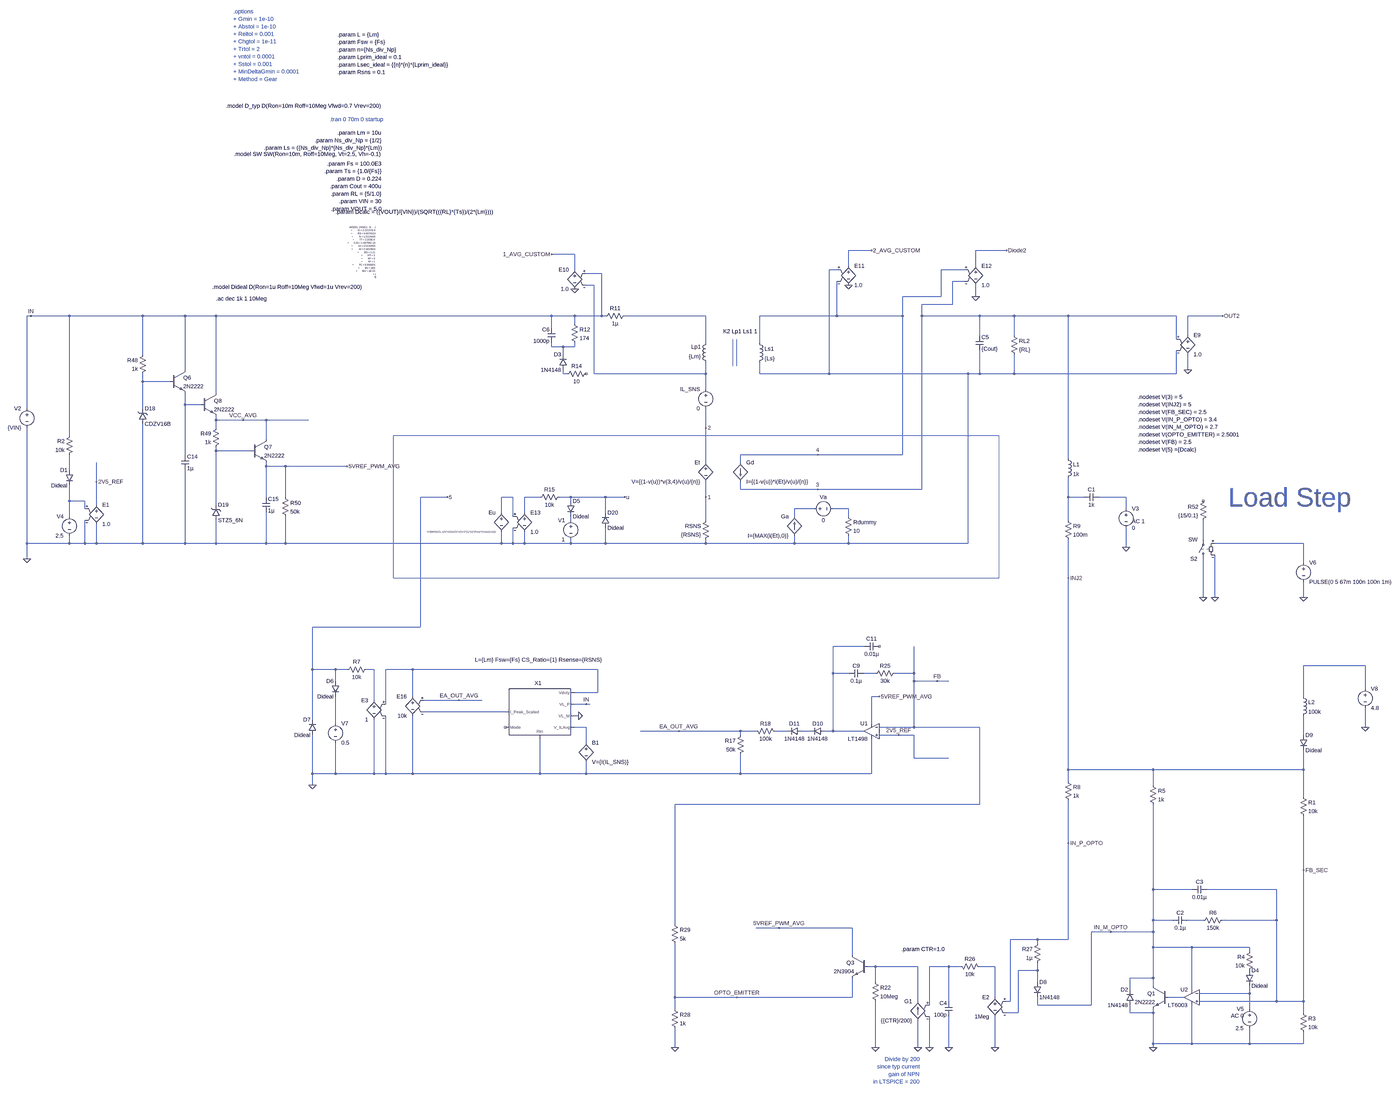
[diagram p0: schematic Flyback_Basic_Model_30V_to_5V_Out_TL431_Opto_FB_AVGD_Model.asc, whole sheet]
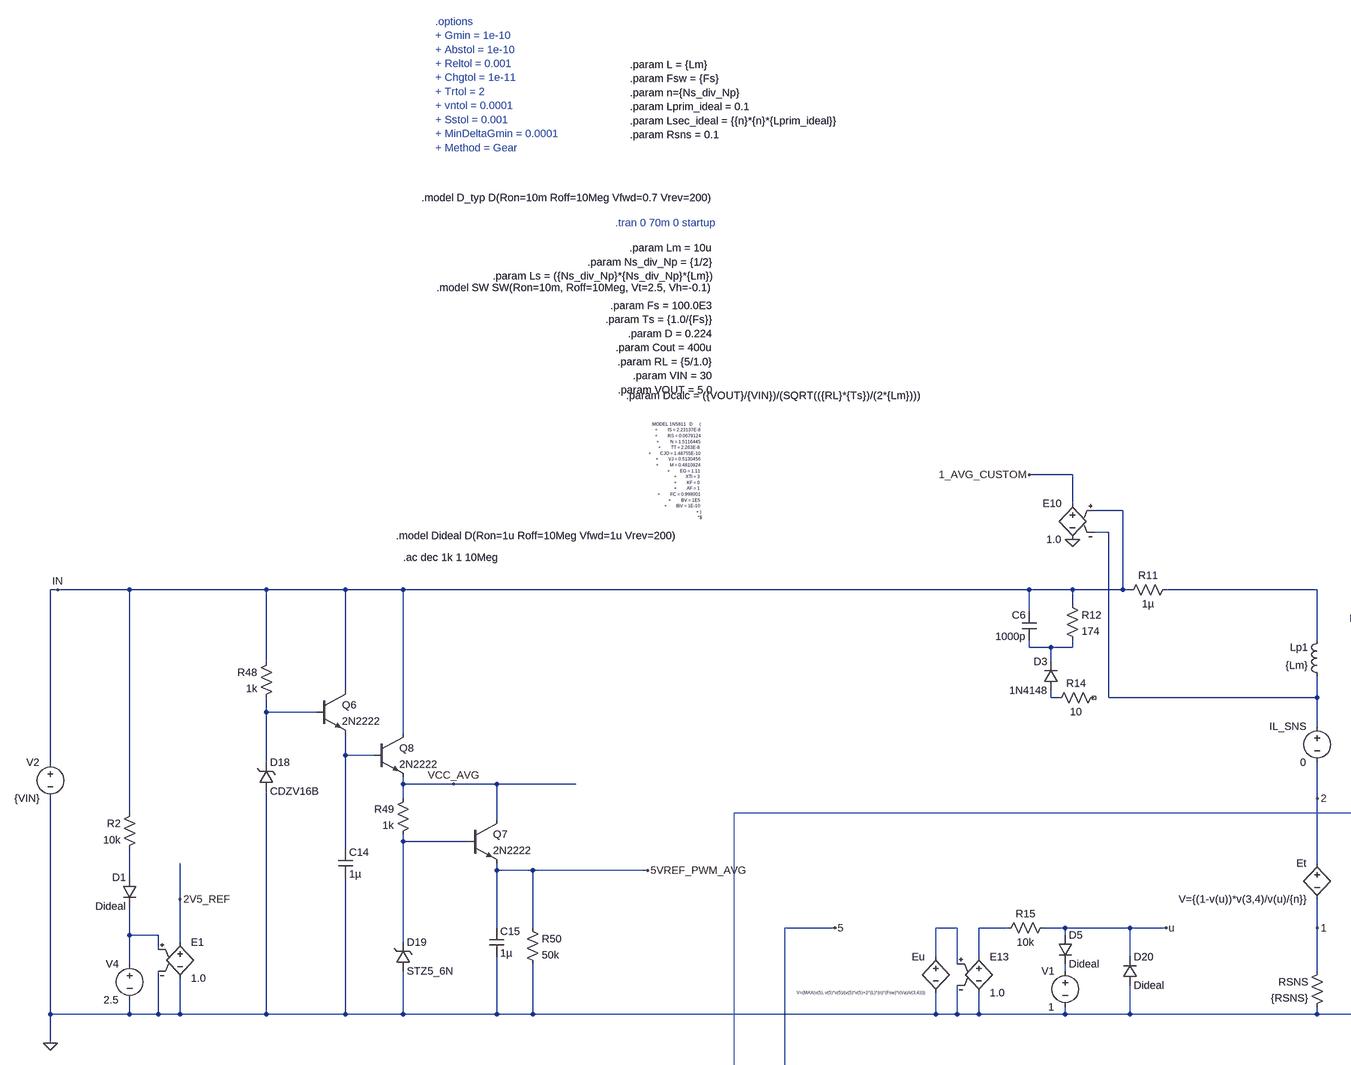
[diagram p1: schematic Flyback_Basic_Model_30V_to_5V_Out_TL431_Opto_FB_AVGD_Model.asc, part, row 1 of 2, column 1 of 2]
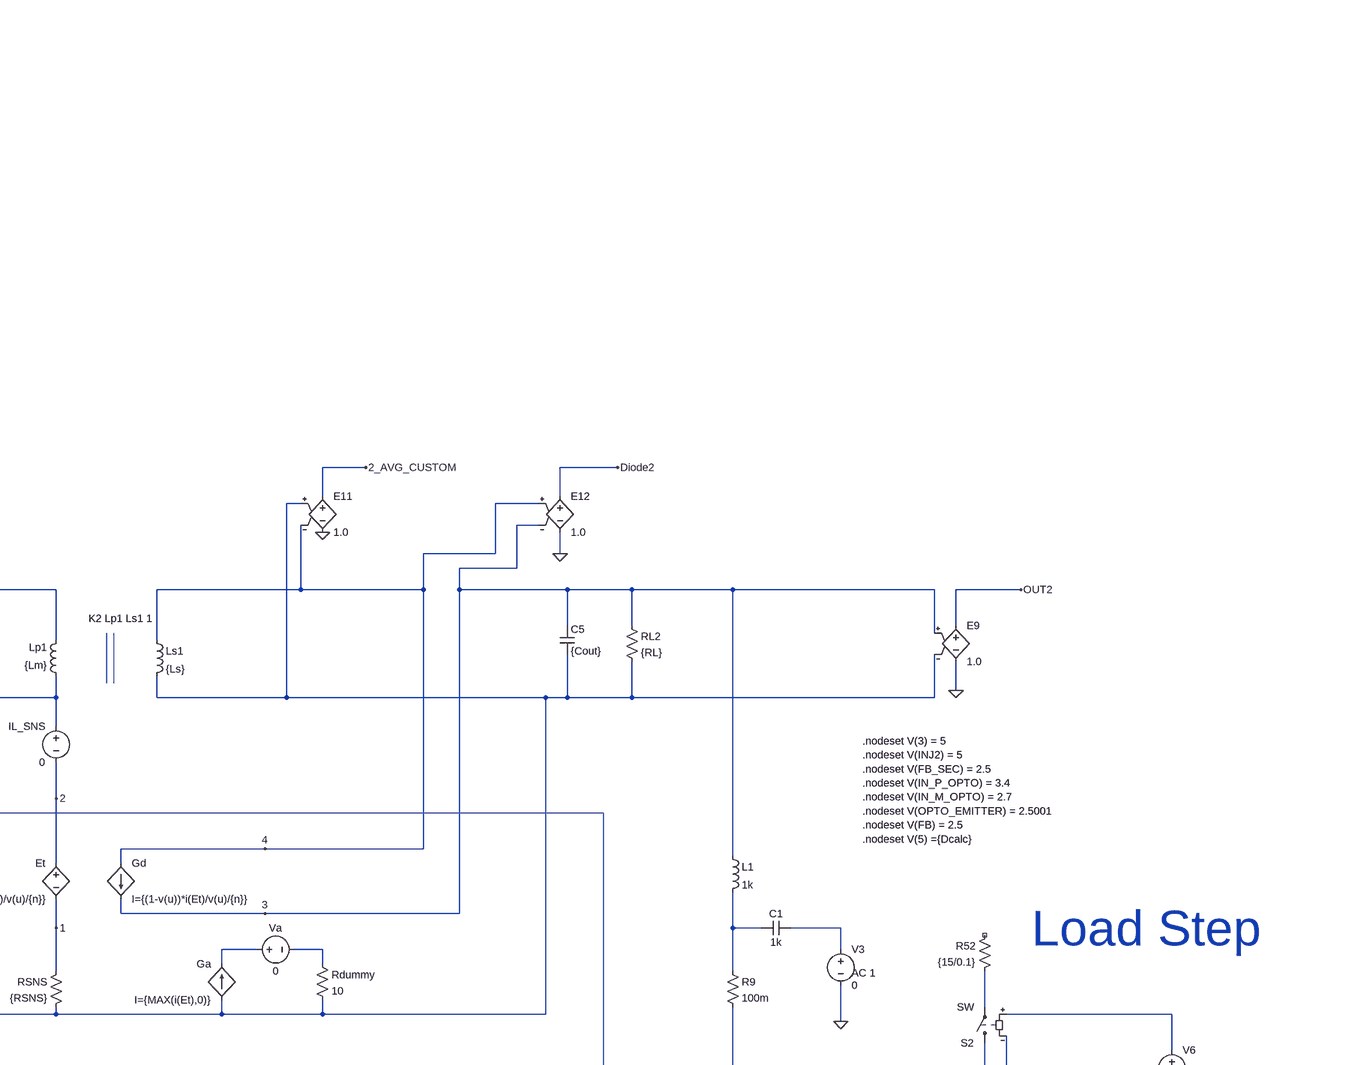
[diagram p2: schematic Flyback_Basic_Model_30V_to_5V_Out_TL431_Opto_FB_AVGD_Model.asc, part, row 1 of 2, column 2 of 2]
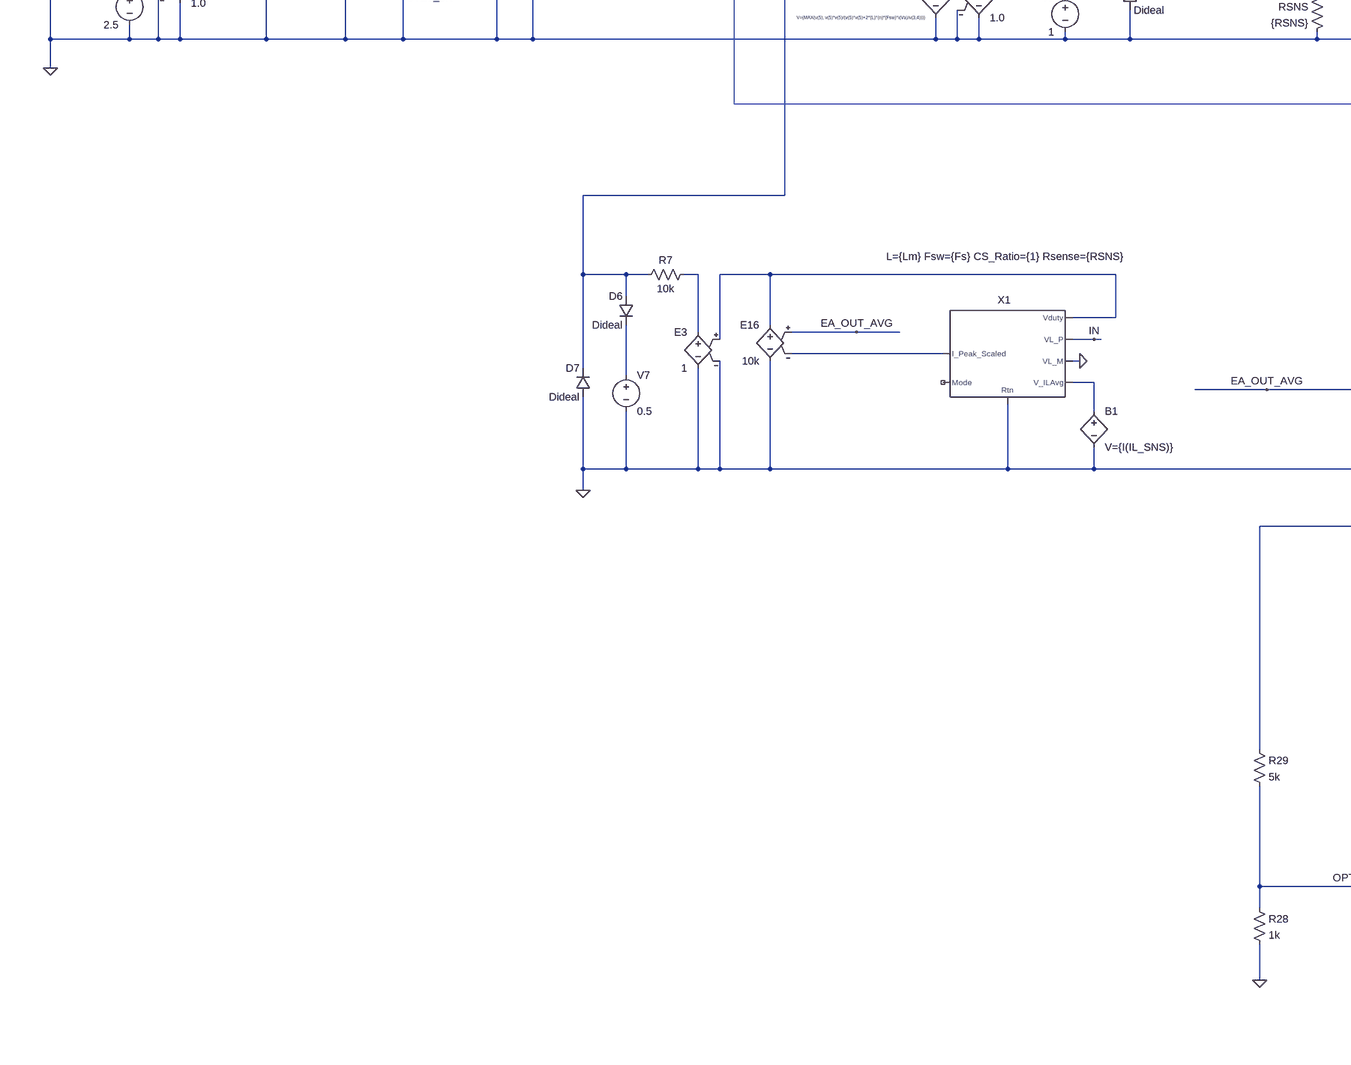
[diagram p3: schematic Flyback_Basic_Model_30V_to_5V_Out_TL431_Opto_FB_AVGD_Model.asc, part, row 2 of 2, column 1 of 2]
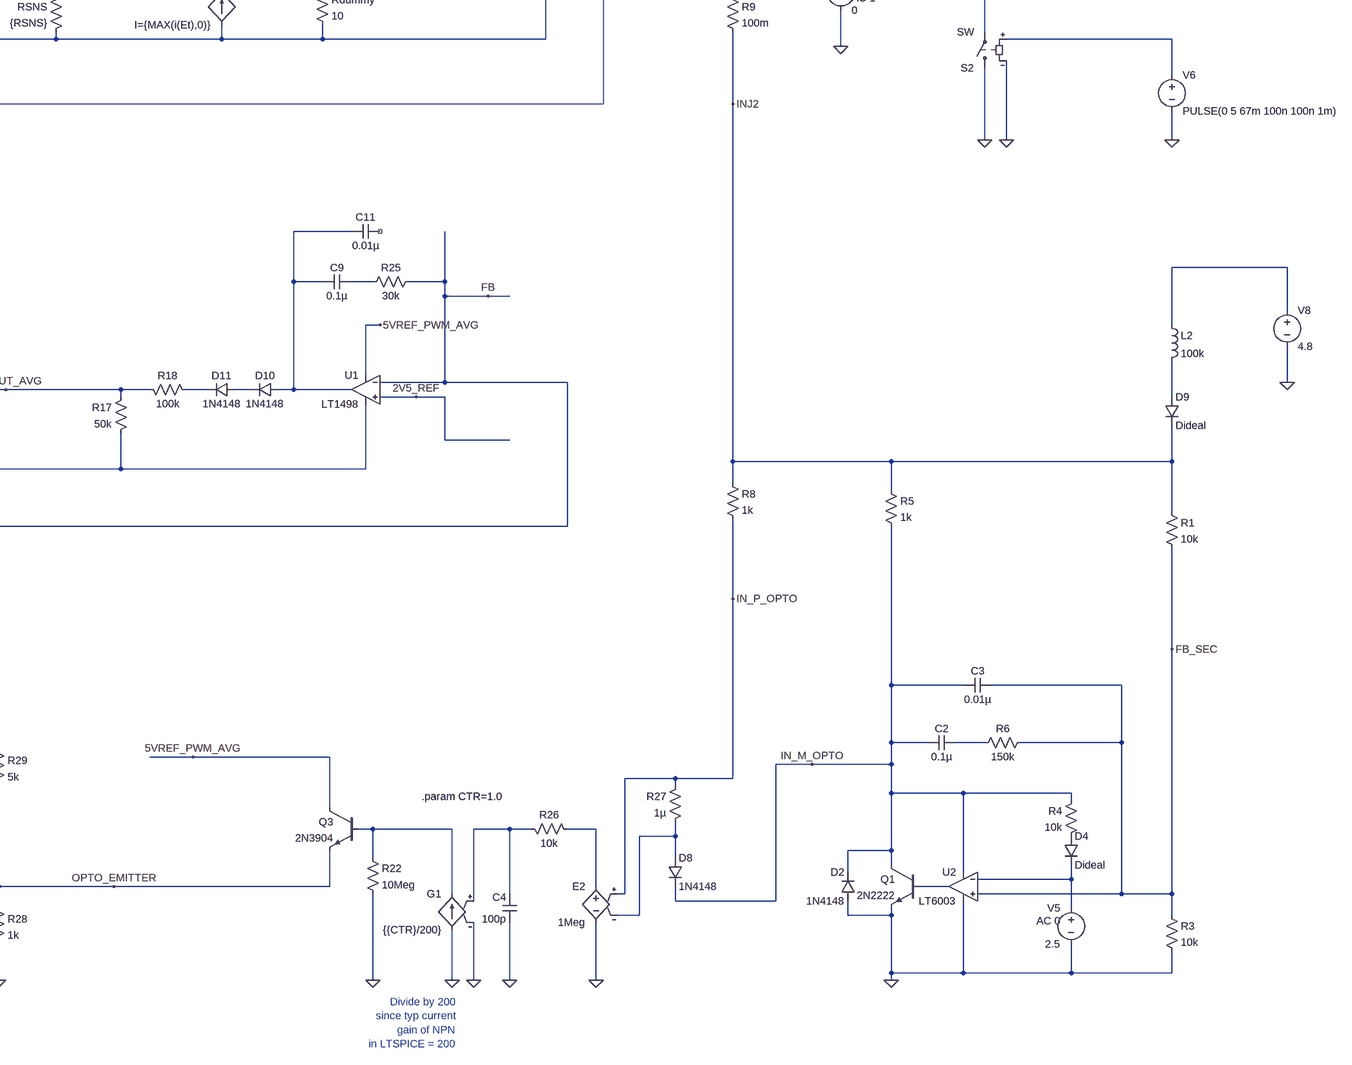
[diagram p4: schematic Flyback_Basic_Model_30V_to_5V_Out_TL431_Opto_FB_AVGD_Model.asc, part, row 2 of 2, column 2 of 2]
Flyback_Basic_Model_30V_to_5V_Out_TL431_Opto_FB_AVGD_Model.asc, the LTspice schematic file:
Version 4.1
SHEET 1 6480 5380
WIRE 3824 944 3728 944
WIRE 4384 944 4256 944
WIRE 2592 960 2496 960
WIRE 3728 1008 3728 944
WIRE 4256 1008 4256 944
WIRE 2592 1024 2592 960
WIRE 3680 1024 3648 1024
WIRE 4208 1024 4112 1024
WIRE 2704 1040 2640 1040
WIRE 4208 1072 4160 1072
WIRE 2672 1088 2640 1088
WIRE 4112 1136 4112 1024
WIRE 4112 1136 3952 1136
WIRE 4256 1136 4256 1088
WIRE 4160 1168 4160 1072
WIRE 4160 1168 4032 1168
WIRE 336 1216 320 1216
WIRE 496 1216 336 1216
WIRE 800 1216 496 1216
WIRE 976 1216 800 1216
WIRE 1104 1216 976 1216
WIRE 2496 1216 1104 1216
WIRE 2592 1216 2496 1216
WIRE 2704 1216 2704 1040
WIRE 2704 1216 2592 1216
WIRE 2720 1216 2704 1216
WIRE 3136 1216 2800 1216
WIRE 3680 1216 3680 1072
WIRE 3680 1216 3360 1216
WIRE 3952 1216 3952 1136
WIRE 3952 1216 3680 1216
WIRE 4032 1216 4032 1168
WIRE 4272 1216 4032 1216
WIRE 4416 1216 4272 1216
WIRE 4640 1216 4416 1216
WIRE 5088 1216 4640 1216
WIRE 5280 1216 5136 1216
WIRE 2592 1248 2592 1216
WIRE 2496 1264 2496 1216
WIRE 4272 1296 4272 1216
WIRE 4416 1296 4416 1216
WIRE 5136 1296 5136 1216
WIRE 5088 1312 5088 1216
WIRE 3136 1328 3136 1216
WIRE 3360 1328 3360 1216
WIRE 2496 1344 2496 1328
WIRE 2544 1344 2496 1344
WIRE 2592 1344 2592 1328
WIRE 2592 1344 2544 1344
WIRE 800 1376 800 1216
WIRE 2544 1376 2544 1344
WIRE 976 1440 976 1216
WIRE 5136 1440 5136 1376
WIRE 2544 1456 2544 1440
WIRE 2560 1456 2544 1456
WIRE 2672 1456 2672 1088
WIRE 3136 1456 3136 1408
WIRE 3136 1456 2672 1456
WIRE 3360 1456 3360 1408
WIRE 3648 1456 3648 1024
WIRE 3648 1456 3360 1456
WIRE 4224 1456 3648 1456
WIRE 4272 1456 4272 1360
WIRE 4272 1456 4224 1456
WIRE 4416 1456 4416 1376
WIRE 4416 1456 4272 1456
WIRE 5088 1456 5088 1360
WIRE 5088 1456 4416 1456
WIRE 800 1488 800 1456
WIRE 912 1488 800 1488
WIRE 3136 1520 3136 1456
WIRE 1104 1536 1104 1216
WIRE 976 1584 976 1536
WIRE 1040 1584 976 1584
WIRE 320 1600 320 1216
WIRE 800 1600 800 1488
WIRE 1104 1648 1104 1632
WIRE 1216 1648 1104 1648
WIRE 1312 1648 1216 1648
WIRE 1488 1648 1312 1648
WIRE 1104 1680 1104 1648
WIRE 3136 1680 3136 1600
WIRE 496 1712 496 1216
WIRE 1312 1728 1312 1648
WIRE 1104 1776 1104 1760
WIRE 1248 1776 1104 1776
WIRE 976 1792 976 1584
WIRE 3600 1792 3280 1792
WIRE 3952 1792 3952 1216
WIRE 3952 1792 3600 1792
WIRE 4640 1808 4640 1216
WIRE 3136 1824 3136 1680
WIRE 3280 1824 3280 1792
WIRE 1312 1840 1312 1824
WIRE 1392 1840 1312 1840
WIRE 1648 1840 1392 1840
WIRE 496 1856 496 1792
WIRE 608 1904 608 1824
WIRE 3280 1936 3280 1904
WIRE 3600 1936 3280 1936
WIRE 4032 1936 4032 1216
WIRE 4032 1936 3600 1936
WIRE 1312 1968 1312 1840
WIRE 1392 1968 1392 1840
WIRE 2064 1968 1952 1968
WIRE 2336 1968 2288 1968
WIRE 2448 1968 2384 1968
WIRE 2576 1968 2528 1968
WIRE 2720 1968 2576 1968
WIRE 2800 1968 2720 1968
WIRE 3136 1968 3136 1904
WIRE 4640 1968 4640 1888
WIRE 4704 1968 4640 1968
WIRE 4880 1968 4768 1968
WIRE 496 1984 496 1920
WIRE 560 1984 496 1984
WIRE 2576 1984 2576 1968
WIRE 608 2000 608 1904
WIRE 1104 2000 1104 1776
WIRE 560 2016 560 1984
WIRE 3584 2016 3504 2016
WIRE 3728 2016 3664 2016
WIRE 4880 2016 4880 1968
WIRE 2288 2032 2288 1968
WIRE 2384 2032 2384 1968
WIRE 2720 2032 2720 1968
WIRE 496 2048 496 1984
WIRE 2336 2048 2336 1968
WIRE 3504 2048 3504 2016
WIRE 3728 2048 3728 2016
WIRE 2576 2064 2576 2048
WIRE 3136 2064 3136 1968
WIRE 4640 2064 4640 1968
WIRE 5200 2144 5200 2064
WIRE 320 2160 320 1680
WIRE 496 2160 496 2128
WIRE 496 2160 320 2160
WIRE 560 2160 560 2064
WIRE 560 2160 496 2160
WIRE 608 2160 608 2080
WIRE 608 2160 560 2160
WIRE 800 2160 800 1664
WIRE 800 2160 608 2160
WIRE 976 2160 976 1856
WIRE 976 2160 800 2160
WIRE 1104 2160 1104 2064
WIRE 1104 2160 976 2160
WIRE 1312 2160 1312 2032
WIRE 1312 2160 1104 2160
WIRE 1392 2160 1392 2048
WIRE 1392 2160 1312 2160
WIRE 2288 2160 2288 2112
WIRE 2288 2160 1392 2160
WIRE 2336 2160 2336 2096
WIRE 2336 2160 2288 2160
WIRE 2384 2160 2384 2112
WIRE 2384 2160 2336 2160
WIRE 2576 2160 2576 2144
WIRE 2576 2160 2384 2160
WIRE 2720 2160 2720 2096
WIRE 2720 2160 2576 2160
WIRE 3136 2160 3136 2144
WIRE 3136 2160 2720 2160
WIRE 3504 2160 3504 2128
WIRE 3504 2160 3136 2160
WIRE 3728 2160 3728 2128
WIRE 3728 2160 3504 2160
WIRE 4224 2160 4224 1456
WIRE 4224 2160 3728 2160
WIRE 5616 2160 5248 2160
WIRE 4880 2176 4880 2096
WIRE 320 2224 320 2160
WIRE 5616 2240 5616 2160
WIRE 4640 2304 4640 2144
WIRE 5200 2384 5200 2224
WIRE 5248 2384 5248 2208
WIRE 5616 2384 5616 2320
WIRE 1952 2544 1952 1968
WIRE 1952 2544 1504 2544
WIRE 3792 2624 3664 2624
WIRE 5872 2704 5616 2704
WIRE 1504 2720 1504 2544
WIRE 1600 2720 1504 2720
WIRE 1648 2720 1600 2720
WIRE 1760 2720 1728 2720
WIRE 1920 2720 1808 2720
WIRE 2688 2720 1920 2720
WIRE 3664 2736 3664 2624
WIRE 3728 2736 3664 2736
WIRE 3840 2736 3792 2736
WIRE 4000 2736 4000 2624
WIRE 4000 2736 3920 2736
WIRE 1600 2768 1600 2720
WIRE 4000 2768 4000 2736
WIRE 4096 2768 4000 2768
WIRE 4144 2768 4096 2768
WIRE 5872 2800 5872 2704
WIRE 2688 2816 2688 2720
WIRE 2688 2816 2592 2816
WIRE 1920 2832 1920 2720
WIRE 3856 2832 3824 2832
WIRE 5616 2832 5616 2704
WIRE 1760 2848 1760 2720
WIRE 2112 2848 1968 2848
WIRE 2208 2848 2112 2848
WIRE 1808 2864 1808 2720
WIRE 2640 2864 2592 2864
WIRE 2656 2864 2640 2864
WIRE 2304 2896 1968 2896
WIRE 2608 2912 2592 2912
WIRE 1504 2928 1504 2720
WIRE 1600 2944 1600 2832
WIRE 3824 2944 3824 2832
WIRE 2640 2960 2592 2960
WIRE 4000 2960 4000 2768
WIRE 4000 2960 3856 2960
WIRE 4272 2960 4000 2960
WIRE 5872 2960 5872 2880
WIRE 3024 2976 2864 2976
WIRE 3280 2976 3024 2976
WIRE 3344 2976 3280 2976
WIRE 3472 2976 3424 2976
WIRE 3568 2976 3536 2976
WIRE 3664 2976 3664 2736
WIRE 3664 2976 3632 2976
WIRE 3792 2976 3664 2976
WIRE 3280 2992 3280 2976
WIRE 3936 2992 3856 2992
WIRE 4000 2992 3936 2992
WIRE 5616 2992 5616 2912
WIRE 2640 3024 2640 2960
WIRE 4000 3088 4000 2992
WIRE 4144 3088 4000 3088
WIRE 4640 3136 4640 2304
WIRE 4992 3136 4640 3136
WIRE 5616 3136 5616 3056
WIRE 5616 3136 4992 3136
WIRE 1504 3152 1504 2992
WIRE 1600 3152 1600 3024
WIRE 1600 3152 1504 3152
WIRE 1760 3152 1760 2928
WIRE 1760 3152 1600 3152
WIRE 1808 3152 1808 2912
WIRE 1808 3152 1760 3152
WIRE 1920 3152 1920 2912
WIRE 1920 3152 1808 3152
WIRE 2448 3152 2448 3008
WIRE 2448 3152 1920 3152
WIRE 2640 3152 2640 3104
WIRE 2640 3152 2448 3152
WIRE 3280 3152 3280 3072
WIRE 3280 3152 2640 3152
WIRE 3824 3152 3824 3008
WIRE 3824 3152 3280 3152
WIRE 4640 3184 4640 3136
WIRE 1504 3200 1504 3152
WIRE 4992 3200 4992 3136
WIRE 5616 3248 5616 3136
WIRE 4272 3280 4272 2960
WIRE 4272 3280 3008 3280
WIRE 4640 3456 4640 3264
WIRE 5616 3568 5616 3328
WIRE 4992 3648 4992 3280
WIRE 5152 3648 4992 3648
WIRE 5504 3648 5216 3648
WIRE 4992 3776 4992 3648
WIRE 5072 3776 4992 3776
WIRE 5200 3776 5136 3776
WIRE 5504 3776 5504 3648
WIRE 5504 3776 5280 3776
WIRE 3008 3792 3008 3280
WIRE 3440 3808 3344 3808
WIRE 3744 3808 3440 3808
WIRE 4816 3824 4736 3824
WIRE 4992 3824 4992 3776
WIRE 4992 3824 4816 3824
WIRE 4512 3856 4400 3856
WIRE 4640 3856 4640 3456
WIRE 4640 3856 4512 3856
WIRE 4512 3872 4512 3856
WIRE 4992 3888 4992 3824
WIRE 5152 3888 4992 3888
WIRE 5392 3888 5152 3888
WIRE 5392 3904 5392 3888
WIRE 3744 3920 3744 3808
WIRE 3840 3968 3808 3968
WIRE 4016 3968 3840 3968
WIRE 4144 3968 4064 3968
WIRE 4192 3968 4144 3968
WIRE 4336 3968 4272 3968
WIRE 4512 3984 4512 3952
WIRE 4512 3984 4432 3984
WIRE 4992 4016 4992 3888
WIRE 4992 4016 4896 4016
WIRE 3840 4032 3840 3968
WIRE 4512 4032 4512 3984
WIRE 4992 4048 4992 4016
WIRE 4896 4064 4896 4016
WIRE 5152 4064 5152 3888
WIRE 5392 4080 5392 4048
WIRE 5392 4080 5184 4080
WIRE 3008 4096 3008 3872
WIRE 3264 4096 3008 4096
WIRE 3744 4096 3744 4016
WIRE 3744 4096 3264 4096
WIRE 4336 4096 4336 3968
WIRE 5120 4096 5056 4096
WIRE 4016 4112 4016 3968
WIRE 4144 4112 4144 3968
WIRE 4400 4112 4400 3856
WIRE 4400 4112 4384 4112
WIRE 5504 4112 5504 3776
WIRE 5504 4112 5184 4112
WIRE 5616 4112 5616 3568
WIRE 5616 4112 5504 4112
WIRE 4064 4128 4064 3968
WIRE 4512 4128 4512 4096
WIRE 4736 4128 4736 3824
WIRE 4736 4128 4512 4128
WIRE 3008 4144 3008 4096
WIRE 5392 4144 5392 4080
WIRE 4432 4160 4432 3984
WIRE 4432 4160 4384 4160
WIRE 4896 4160 4896 4128
WIRE 4992 4160 4992 4144
WIRE 4992 4160 4896 4160
WIRE 5616 4160 5616 4112
WIRE 4992 4288 4992 4160
WIRE 5152 4288 5152 4128
WIRE 5152 4288 4992 4288
WIRE 5392 4288 5392 4224
WIRE 5392 4288 5152 4288
WIRE 5616 4288 5616 4240
WIRE 5616 4288 5392 4288
WIRE 3008 4304 3008 4224
WIRE 3840 4304 3840 4112
WIRE 4016 4304 4016 4192
WIRE 4064 4304 4064 4176
WIRE 4144 4304 4144 4176
WIRE 4336 4304 4336 4176
WIRE 4992 4304 4992 4288
FLAG 5136 1440 0
FLAG 5280 1216 OUT2
FLAG 2592 1104 0
FLAG 3728 1088 0
FLAG 2496 960 1_AVG_CUSTOM
FLAG 3824 944 2_AVG_CUSTOM
FLAG 4256 1136 0
FLAG 4384 944 Diode2
FLAG 2064 1968 5
FLAG 2800 1968 u
FLAG 3600 1792 4
FLAG 3600 1936 3
FLAG 1216 1648 VCC_AVG
FLAG 1648 1840 5VREF_PWM_AVG
FLAG 3856 2832 5VREF_PWM_AVG
FLAG 3024 2976 EA_OUT_AVG
FLAG 5200 2384 0
FLAG 5248 2384 0
FLAG 5616 2384 0
FLAG 3136 1680 2
FLAG 3136 1968 1
FLAG 320 2224 0
FLAG 336 1216 IN
FLAG 3936 2992 2V5_REF
FLAG 2640 2864 IN
FLAG 2112 2848 EA_OUT_AVG
FLAG 2608 2912 0
FLAG 4640 2304 INJ2
FLAG 4096 2768 FB
FLAG 608 1904 2V5_REF
FLAG 4880 2176 0
FLAG 4992 4304 0
FLAG 3840 4304 0
FLAG 4016 4304 0
FLAG 4064 4304 0
FLAG 4144 4304 0
FLAG 4336 4304 0
FLAG 3008 4304 0
FLAG 3440 3808 5VREF_PWM_AVG
FLAG 5616 3568 FB_SEC
FLAG 4816 3824 IN_M_OPTO
FLAG 1504 3200 0
FLAG 4640 3456 IN_P_OPTO
FLAG 3264 4096 OPTO_EMITTER
FLAG 5872 2960 0
DATAFLAG 4672 1216 ""
DATAFLAG 4064 2960 ""
DATAFLAG 2352 1216 ""
DATAFLAG 2720 1968 ""
DATAFLAG 1968 1968 ""
DATAFLAG 3264 2976 ""
DATAFLAG 4096 3088 ""
DATAFLAG 2128 2896 ""
DATAFLAG 5136 3888 ""
DATAFLAG 5360 3776 ""
DATAFLAG 5552 4112 ""
DATAFLAG 3696 3808 ""
DATAFLAG 3424 4096 ""
DATAFLAG 5264 4080 ""
DATAFLAG 4704 4128 ""
DATAFLAG 1536 1840 ""
DATAFLAG 1392 1648 ""
DATAFLAG 2096 2720 ""
DATAFLAG 5024 3136 ""
DATAFLAG 4448 3984 ""
DATAFLAG 2384 1968 ""
DATAFLAG 4640 3696 ""
SYMBOL res 4400 1280 R0
SYMATTR InstName RL2
SYMATTR Value {RL}
SYMBOL cap 4256 1296 R0
SYMATTR InstName C5
SYMATTR Value {Cout}
SYMBOL e 5136 1280 R0
SYMATTR InstName E9
SYMATTR Value 1.0
SYMBOL res 2704 1232 R270
WINDOW 0 32 56 VTop 2
WINDOW 3 0 56 VBottom 2
SYMATTR InstName R11
SYMATTR Value 1µ
SYMBOL e 2592 1008 M0
SYMATTR InstName E10
SYMATTR Value 1.0
SYMBOL e 3728 992 R0
SYMATTR InstName E11
SYMATTR Value 1.0
SYMBOL diode 2560 1440 R180
WINDOW 0 24 64 Left 2
WINDOW 3 24 0 Left 2
SYMATTR InstName D3
SYMATTR Value 1N4148
SYMBOL cap 2512 1264 M0
SYMATTR InstName C6
SYMATTR Value 1000p
SYMBOL res 2576 1232 R0
SYMATTR InstName R12
SYMATTR Value 174
SYMBOL e 4256 992 R0
SYMATTR InstName E12
SYMATTR Value 1.0
SYMBOL res 2656 1440 R90
WINDOW 0 0 56 VBottom 2
WINDOW 3 32 56 VTop 2
SYMATTR InstName R14
SYMATTR Value 10
SYMBOL res 3152 2048 M0
SYMATTR InstName RSNS
SYMATTR Value {RSNS}
SYMBOL bv 2288 2016 M0
WINDOW 3 24 96 Left 0
SYMATTR Value V={MAX(v(5), v(5)*v(5)/(v(5)*v(5)+2*{L}*{n}*{Fsw}*i(Va)/v(3,4)))}
SYMATTR InstName Eu
SYMBOL bv 3136 1808 M0
SYMATTR InstName Et
SYMATTR Value V={(1-v(u))*v(3,4)/v(u)/{n}}
SYMBOL bi 3280 1824 R0
SYMATTR InstName Gd
SYMATTR Value I={(1-v(u))*i(Et)/v(u)/{n}}
SYMBOL bi 3504 2128 R180
WINDOW 0 24 80 Left 2
WINDOW 3 24 0 Left 2
SYMATTR InstName Ga
SYMATTR Value I={MAX(i(Et),0)}
SYMBOL voltage 3568 2016 R270
WINDOW 0 32 56 VTop 2
WINDOW 3 -32 56 VBottom 2
WINDOW 123 0 0 Left 0
WINDOW 39 0 0 Left 0
SYMATTR InstName Va
SYMATTR Value 0
SYMBOL res 3712 2032 R0
SYMATTR InstName Rdummy
SYMATTR Value 10
SYMBOL e 2384 2016 R0
SYMATTR InstName E13
SYMATTR Value 1.0
SYMBOL res 2544 1952 R90
WINDOW 0 0 56 VBottom 2
WINDOW 3 32 56 VTop 2
SYMATTR InstName R15
SYMATTR Value 10k
SYMBOL diode 2560 1984 R0
SYMATTR InstName D5
SYMATTR Value Dideal
SYMBOL voltage 2576 2048 M0
WINDOW 123 0 0 Left 0
WINDOW 39 0 0 Left 0
SYMATTR InstName V1
SYMATTR Value 1
SYMBOL diode 3632 2992 M270
WINDOW 0 32 32 VTop 2
WINDOW 3 0 32 VBottom 2
SYMATTR InstName D10
SYMATTR Value 1N4148
SYMBOL diode 3536 2992 M270
WINDOW 0 32 32 VTop 2
WINDOW 3 0 32 VBottom 2
SYMATTR InstName D11
SYMATTR Value 1N4148
SYMBOL res 3296 2976 M0
SYMATTR InstName R17
SYMATTR Value 50k
SYMBOL res 3440 2992 M270
WINDOW 0 32 56 VTop 2
WINDOW 3 0 56 VBottom 2
SYMATTR InstName R18
SYMATTR Value 100k
SYMBOL cap 3792 2720 R90
WINDOW 0 0 32 VBottom 2
WINDOW 3 32 32 VTop 2
SYMATTR InstName C9
SYMATTR Value 0.1µ
SYMBOL res 3936 2720 R90
WINDOW 0 0 56 VBottom 2
WINDOW 3 32 56 VTop 2
SYMATTR InstName R25
SYMATTR Value 30k
SYMBOL cap 3856 2608 R90
WINDOW 0 0 32 VBottom 2
WINDOW 3 32 32 VTop 2
SYMATTR InstName C11
SYMATTR Value 0.01µ
SYMBOL zener 784 1664 M180
WINDOW 0 24 64 Left 2
WINDOW 3 24 0 Left 2
SYMATTR InstName D18
SYMATTR Value CDZV16B
SYMBOL res 816 1360 M0
SYMATTR InstName R48
SYMATTR Value 1k
SYMBOL npn 912 1440 R0
SYMATTR InstName Q6
SYMATTR Value 2N2222
SYMBOL cap 960 1792 R0
SYMATTR InstName C14
SYMATTR Value 1µ
SYMBOL zener 1088 2064 M180
WINDOW 0 24 64 Left 2
WINDOW 3 24 0 Left 2
SYMATTR InstName D19
SYMATTR Value STZ5_6N
SYMBOL res 1120 1664 M0
SYMATTR InstName R49
SYMATTR Value 1k
SYMBOL npn 1248 1728 R0
SYMATTR InstName Q7
SYMATTR Value 2N2222
SYMBOL cap 1296 1968 R0
SYMATTR InstName C15
SYMATTR Value 1µ
SYMBOL res 1376 1952 R0
SYMATTR InstName R50
SYMATTR Value 50k
SYMBOL npn 1040 1536 R0
SYMATTR InstName Q8
SYMATTR Value 2N2222
SYMBOL sw 5200 2240 R180
SYMATTR InstName S2
SYMBOL res 5216 1968 M0
SYMATTR InstName R52
SYMATTR Value {15/0.1}
SYMBOL voltage 5616 2224 R0
WINDOW 123 0 0 Left 0
WINDOW 39 0 0 Left 0
SYMATTR InstName V6
SYMATTR Value PULSE(0 5 67m 100n 100n 1m)
SYMBOL voltage 3136 1504 M0
WINDOW 123 0 0 Left 0
WINDOW 39 0 0 Left 0
SYMATTR InstName IL_SNS
SYMATTR Value 0
SYMBOL ind 3152 1424 R180
WINDOW 0 36 80 Left 2
WINDOW 3 36 40 Left 2
SYMATTR InstName Lp1
SYMATTR Value {Lm}
SYMATTR Type ind
SYMBOL ind 3344 1312 R0
SYMATTR InstName Ls1
SYMATTR Value {Ls}
SYMATTR Type ind
SYMBOL Peak_Current_Sense 2448 2896 M0
WINDOW 39 7 -201 Bottom 2
SYMATTR SpiceLine L={Lm} Fsw={Fs} CS_Ratio={1} Rsense={RSNS}
SYMATTR InstName X1
SYMBOL e 1920 2816 M0
SYMATTR InstName E16
SYMATTR Value 10k
SYMBOL diode 2704 2096 M180
WINDOW 0 24 64 Left 2
WINDOW 3 24 0 Left 2
SYMATTR InstName D20
SYMATTR Value Dideal
SYMBOL voltage 320 1584 M0
WINDOW 123 0 0 Left 0
WINDOW 39 0 0 Left 0
SYMATTR InstName V2
SYMATTR Value {VIN}
SYMBOL voltage 4880 2000 R0
WINDOW 123 24 68 Left 2
WINDOW 39 0 0 Left 0
SYMATTR Value2 AC 1
SYMATTR InstName V3
SYMATTR Value 0
SYMBOL res 512 1696 M0
SYMATTR InstName R2
SYMATTR Value 10k
SYMBOL voltage 496 2032 M0
WINDOW 123 0 0 Left 0
WINDOW 39 0 0 Left 0
SYMATTR InstName V4
SYMATTR Value 2.5
SYMBOL diode 512 1856 M0
SYMATTR InstName D1
SYMATTR Value Dideal
SYMBOL e 608 1984 R0
SYMATTR InstName E1
SYMATTR Value 1.0
SYMBOL OpAmps\\LT1498 3824 2912 M0
SYMATTR InstName U1
SYMBOL res 5600 3232 R0
SYMATTR InstName R1
SYMATTR Value 10k
SYMBOL res 5600 4144 R0
SYMATTR InstName R3
SYMATTR Value 10k
SYMBOL npn 5056 4048 M0
SYMATTR InstName Q1
SYMATTR Value 2N2222
SYMBOL diode 4912 4128 R180
WINDOW 0 24 64 Left 2
WINDOW 3 24 0 Left 2
SYMATTR InstName D2
SYMATTR Value 1N4148
SYMBOL diode 5376 3984 R0
SYMATTR InstName D4
SYMATTR Value Dideal
SYMBOL voltage 5392 4128 M0
WINDOW 123 24 44 Left 2
WINDOW 39 0 0 Left 0
SYMATTR Value2 AC 0
SYMATTR InstName V5
SYMATTR Value 2.5
SYMBOL res 5408 3888 M0
SYMATTR InstName R4
SYMATTR Value 10k
SYMBOL res 4976 3184 R0
SYMATTR InstName R5
SYMATTR Value 1k
SYMBOL cap 5136 3760 R90
WINDOW 0 0 32 VBottom 2
WINDOW 3 32 32 VTop 2
SYMATTR InstName C2
SYMATTR Value 0.1µ
SYMBOL res 5296 3760 R90
WINDOW 0 0 56 VBottom 2
WINDOW 3 32 56 VTop 2
SYMATTR InstName R6
SYMATTR Value 150k
SYMBOL diode 4496 4032 R0
SYMATTR InstName D8
SYMATTR Value 1N4148
SYMBOL res 3824 4016 R0
SYMATTR InstName R22
SYMATTR Value 10Meg
SYMBOL npn 3808 3920 M0
SYMATTR InstName Q3
SYMATTR Value 2N3904
SYMBOL g 4016 4096 M0
SYMATTR InstName G1
SYMATTR Value {{CTR}/200}
SYMBOL cap 4160 4112 M0
SYMATTR InstName C4
SYMATTR Value 100p
SYMBOL res 4176 3952 M90
WINDOW 0 0 56 VBottom 2
WINDOW 3 32 56 VTop 2
SYMATTR InstName R26
SYMATTR Value 10k
SYMBOL res 4528 3856 M0
SYMATTR InstName R27
SYMATTR Value 1µ
SYMBOL e 4336 4080 M0
SYMATTR InstName E2
SYMATTR Value 1Meg
SYMBOL res 2992 4128 R0
SYMATTR InstName R28
SYMATTR Value 1k
SYMBOL res 2992 3776 R0
SYMATTR InstName R29
SYMATTR Value 5k
SYMBOL ind 4624 1792 R0
SYMATTR InstName L1
SYMATTR Value 1k
SYMATTR SpiceLine Rser=0
SYMBOL cap 4768 1952 R90
WINDOW 0 0 32 VBottom 2
WINDOW 3 32 32 VTop 2
SYMATTR InstName C1
SYMATTR Value 1k
SYMBOL bv 2640 3008 R0
SYMATTR InstName B1
SYMATTR Value V={I(IL_SNS)}
SYMBOL diode 1616 2768 M0
SYMATTR InstName D6
SYMATTR Value Dideal
SYMBOL voltage 1600 2928 R0
WINDOW 123 0 0 Left 0
WINDOW 39 0 0 Left 0
SYMATTR InstName V7
SYMATTR Value 0.5
SYMBOL diode 1520 2992 R180
WINDOW 0 24 64 Left 2
WINDOW 3 24 0 Left 2
SYMATTR InstName D7
SYMATTR Value Dideal
SYMBOL e 1760 2832 M0
SYMATTR InstName E3
SYMATTR Value 1
SYMBOL res 1744 2704 R90
WINDOW 0 0 56 VBottom 2
WINDOW 3 32 56 VTop 2
SYMATTR InstName R7
SYMATTR Value 10k
SYMBOL OpAmps\\LT6003 5152 4096 M0
SYMATTR InstName U2
SYMBOL res 4624 3168 R0
SYMATTR InstName R8
SYMATTR Value 1k
SYMBOL res 4624 2048 R0
SYMATTR InstName R9
SYMATTR Value 100m
SYMBOL cap 5216 3632 R90
WINDOW 0 0 32 VBottom 2
WINDOW 3 32 32 VTop 2
SYMATTR InstName C3
SYMATTR Value 0.01µ
SYMBOL diode 5600 2992 R0
SYMATTR InstName D9
SYMATTR Value Dideal
SYMBOL ind 5600 2816 R0
SYMATTR InstName L2
SYMATTR Value 100k
SYMATTR SpiceLine Rser=0
SYMBOL voltage 5872 2784 R0
WINDOW 123 0 0 Left 0
WINDOW 39 0 0 Left 0
SYMATTR InstName V8
SYMATTR Value 4.8
TEXT 5304 1968 Left 7 ;Load Step
TEXT 3208 1280 Left 2 !K2 Lp1 Ls1 1
TEXT 4928 1552 Left 2 !.nodeset V(3) = 5\n.nodeset V(INJ2) = 5\n.nodeset V(FB_SEC) = 2.5\n.nodeset V(IN_P_OPTO) = 3.4\n.nodeset V(IN_M_OPTO) = 2.7\n.nodeset V(OPTO_EMITTER) = 2.5001\n.nodeset V(FB) = 2.5\n.nodeset V(5) ={Dcalc}
TEXT 1800 400 Right 2 ;.tran 0 70m 0 startup
TEXT 1792 544 Right 2 !.model SW SW(Ron=10m, Roff=10Meg, Vt=2.5, Vh=-0.1)
TEXT 1792 584 Right 2 !.param Fs = 100.0E3\n.param Ts = {1.0/{Fs}}\n.param D = 0.224\n.param Cout = 400u\n.param RL = {5/1.0}\n.param VIN = 30\n.param VOUT = 5.0
TEXT 1792 344 Right 2 !.model D_typ D(Ron=10m Roff=10Meg Vfwd=0.7 Vrev=200)
TEXT 1792 456 Right 2 !.param Lm = 10u\n.param Ns_div_Np = {1/2}\n.param Ls = ({Ns_div_Np}*{Ns_div_Np}*{Lm})
TEXT 1608 48 Left 2 !.param L = {Lm}\n.param Fsw = {Fs}\n.param n={Ns_div_Np}\n.param Lprim_ideal = 0.1\n.param Lsec_ideal = {{n}*{n}*{Lprim_ideal}}\n.param Rsns = 0.1
TEXT 1768 848 Right 0 !.MODEL 1N5811   D      (\n+         IS = 2.23137E-8\n+         RS = 0.0679124\n+          N = 1.5116445\n+         TT = 2.263E-8\n+        CJO = 1.48755E-10\n+         VJ = 0.5130456\n+          M = 0.4810824\n+         EG = 1.11\n+        XTI = 3\n+         KF = 0\n+         AF = 1\n+         FC = 0.998001\n+         BV = 1E5\n+        IBV = 1E-10\n+ )\n*$
TEXT 1176 -48 Left 2 ;.options\n+ Gmin = 1e-10\n+ Abstol = 1e-10\n+ Reltol = 0.001\n+ Chgtol = 1e-11\n+ Trtol = 2\n+ vntol = 0.0001\n+ Sstol = 0.001\n+ MinDeltaGmin = 0.0001\n+ Method = Gear
TEXT 1088 1096 Left 2 !.model Dideal D(Ron=1u Roff=10Meg Vfwd=1u Vrev=200)
TEXT 4128 3896 Right 2 !.param CTR=1.0
TEXT 4024 4352 Right 2 ;Divide by 200\nsince typ current\ngain of NPN\nin LTSPICE = 200
TEXT 1104 1144 Left 2 !.ac dec 1k 1 10Meg
TEXT 1600 784 Left 2 !.param Dcalc = ({VOUT}/{VIN})/(SQRT(({RL}*{Ts})/(2*{Lm})))
LINE Normal 3248 1424 3248 1312
LINE Normal 3264 1424 3264 1312
RECTANGLE Normal 4352 2304 1840 1712

The netlist it stands for:
* Flyback_Basic_Model_30V_to_5V_Out_TL431_Opto_FB_AVGD_Model.asc
RL2 3 0 {RL}
C5 3 0 {Cout}
E9 OUT2 0 3 0 1.0
R11 IN N002 1µ
E10 1_AVG_CUSTOM 0 IN N001 1.0
E11 2_AVG_CUSTOM 0 0 4 1.0
D3 N004 N003 1N4148
C6 IN N003 1000p
R12 IN N003 174
E12 Diode2 0 4 3 1.0
R14 NC_01 N004 10
RSNS 1 0 {RSNS}
B§Eu N009 0 V={MAX(v(5), v(5)*v(5)/(v(5)*v(5)+2*{L}*{n}*{Fsw}*i(Va)/v(3,4)))}
B§Et 2 1 V={(1-v(u))*v(3,4)/v(u)/{n}}
B§Gd 4 3 I={(1-v(u))*i(Et)/v(u)/{n}}
B§Ga 0 N014 I={MAX(i(Et),0)}
Va N014 N015 0
Rdummy N015 0 10
E13 N010 0 N009 0 1.0
R15 u N010 10k
D5 u N016 Dideal
V1 N016 0 1
D10 N019 N028 1N4148
D11 N028 N027 1N4148
R17 EA_OUT_AVG 0 50k
R18 N027 EA_OUT_AVG 100k
C9 N023 N019 0.1µ
R25 FB N023 30k
C11 NC_02 N019 0.01µ
D18 0 N005 CDZV16B
R48 IN N005 1k
Q6 IN N005 N006 0 2N2222
C14 N006 0 1µ
D19 0 N007 STZ5_6N
R49 VCC_AVG N007 1k
Q7 VCC_AVG N007 5VREF_PWM_AVG 0 2N2222
C15 5VREF_PWM_AVG 0 1µ
R50 5VREF_PWM_AVG 0 50k
Q8 IN N006 VCC_AVG 0 2N2222
S2 0 N017 N018 0 SW
R52 NC_03 N017 {15/0.1}
V6 N018 0 PULSE(0 5 67m 100n 100n 1m)
V§IL_SNS N001 2 0
Lp1 N001 N002 {Lm}
Ls1 4 0 {Ls}
X§X1 N024 0 N026 N022 0 IN NC_04 Peak_Current_Sense params: L={Lm} Fsw={Fs} CS_Ratio={1} Rsense={RSNS}  ; pins I_Peak_Scaled Rtn V_ILAvg Vduty VL_M VL_P Mode
E16 N022 0 EA_OUT_AVG N024 10k
D20 0 u Dideal
V2 IN 0 {VIN}
V3 N012 0 0 AC 1
R2 IN N008 10k
V4 N013 0 2.5
D1 N008 N013 Dideal
E1 2V5_REF 0 N013 0 1.0
X§U1 2V5_REF FB 5VREF_PWM_AVG 0 N019 LT1498  ; pins In+ In- V+ V- OUT
R1 INJ2 FB_SEC 10k
R3 FB_SEC 0 10k
Q1 IN_M_OPTO N036 0 0 2N2222
D2 0 IN_M_OPTO 1N4148
D4 P001 N035 Dideal
V5 N035 0 2.5 AC 0
R4 IN_M_OPTO P001 10k
R5 INJ2 IN_M_OPTO 1k
C2 N030 IN_M_OPTO 0.1µ
R6 FB_SEC N030 150k
D8 N034 IN_M_OPTO 1N4148
R22 N031 0 10Meg
Q3 5VREF_PWM_AVG N031 OPTO_EMITTER 0 2N3904
G1 0 N031 N032 0 {{CTR}/200}
C4 N032 0 100p
R26 N032 N033 10k
R27 IN_P_OPTO N034 1µ
E2 N033 0 IN_P_OPTO N034 1Meg
R28 OPTO_EMITTER 0 1k
R29 FB OPTO_EMITTER 5k
L1 3 N011 1k Rser=0
C1 N012 N011 1k
B1 N026 0 V={I(IL_SNS)}
D6 5 N025 Dideal
V7 N025 0 0.5
D7 0 5 Dideal
E3 N021 0 N022 0 1
R7 N021 5 10k
* U2: LT6003 (symbol OpAmps\LT6003 not available, pins judged from their places): In+=FB_SEC In-=N035 V+=IN_M_OPTO V-=0 OUT=N036
R8 INJ2 IN_P_OPTO 1k
R9 N011 INJ2 100m
C3 FB_SEC IN_M_OPTO 0.01µ
D9 N029 INJ2 Dideal
L2 N020 N029 100k Rser=0
V8 N020 0 4.8
.model D D
.lib standard.dio
.model NPN NPN
.model PNP PNP
.lib standard.bjt
* Load Step
K2 Lp1 Ls1 1
.nodeset V(3) = 5
.nodeset V(INJ2) = 5
.nodeset V(FB_SEC) = 2.5
.nodeset V(IN_P_OPTO) = 3.4
.nodeset V(IN_M_OPTO) = 2.7
.nodeset V(OPTO_EMITTER) = 2.5001
.nodeset V(FB) = 2.5
.nodeset V(5) ={Dcalc}
* .tran 0 70m 0 startup
.model SW SW(Ron=10m, Roff=10Meg, Vt=2.5, Vh=-0.1)
.param Fs = 100.0E3
.param Ts = {1.0/{Fs}}
.param D = 0.224
.param Cout = 400u
.param RL = {5/1.0}
.param VIN = 30
.param VOUT = 5.0
.model D_typ D(Ron=10m Roff=10Meg Vfwd=0.7 Vrev=200)
.param Lm = 10u
.param Ns_div_Np = {1/2}
.param Ls = ({Ns_div_Np}*{Ns_div_Np}*{Lm})
.param L = {Lm}
.param Fsw = {Fs}
.param n={Ns_div_Np}
.param Lprim_ideal = 0.1
.param Lsec_ideal = {{n}*{n}*{Lprim_ideal}}
.param Rsns = 0.1
.MODEL 1N5811   D      (
+         IS = 2.23137E-8
+         RS = 0.0679124
+          N = 1.5116445
+         TT = 2.263E-8
+        CJO = 1.48755E-10
+         VJ = 0.5130456
+          M = 0.4810824
+         EG = 1.11
+        XTI = 3
+         KF = 0
+         AF = 1
+         FC = 0.998001
+         BV = 1E5
+        IBV = 1E-10
+ )
*$
* .options
* + Gmin = 1e-10
* + Abstol = 1e-10
* + Reltol = 0.001
* + Chgtol = 1e-11
* + Trtol = 2
* + vntol = 0.0001
* + Sstol = 0.001
* + MinDeltaGmin = 0.0001
* + Method = Gear
.model Dideal D(Ron=1u Roff=10Meg Vfwd=1u Vrev=200)
.param CTR=1.0
* Divide by 200
* since typ current
* gain of NPN
* in LTSPICE = 200
.ac dec 1k 1 10Meg
.param Dcalc = ({VOUT}/{VIN})/(SQRT(({RL}*{Ts})/(2*{Lm})))
.lib LTC.lib
.backanno
.end